# EAGLE design joytester (EAGLE 9.0.1)
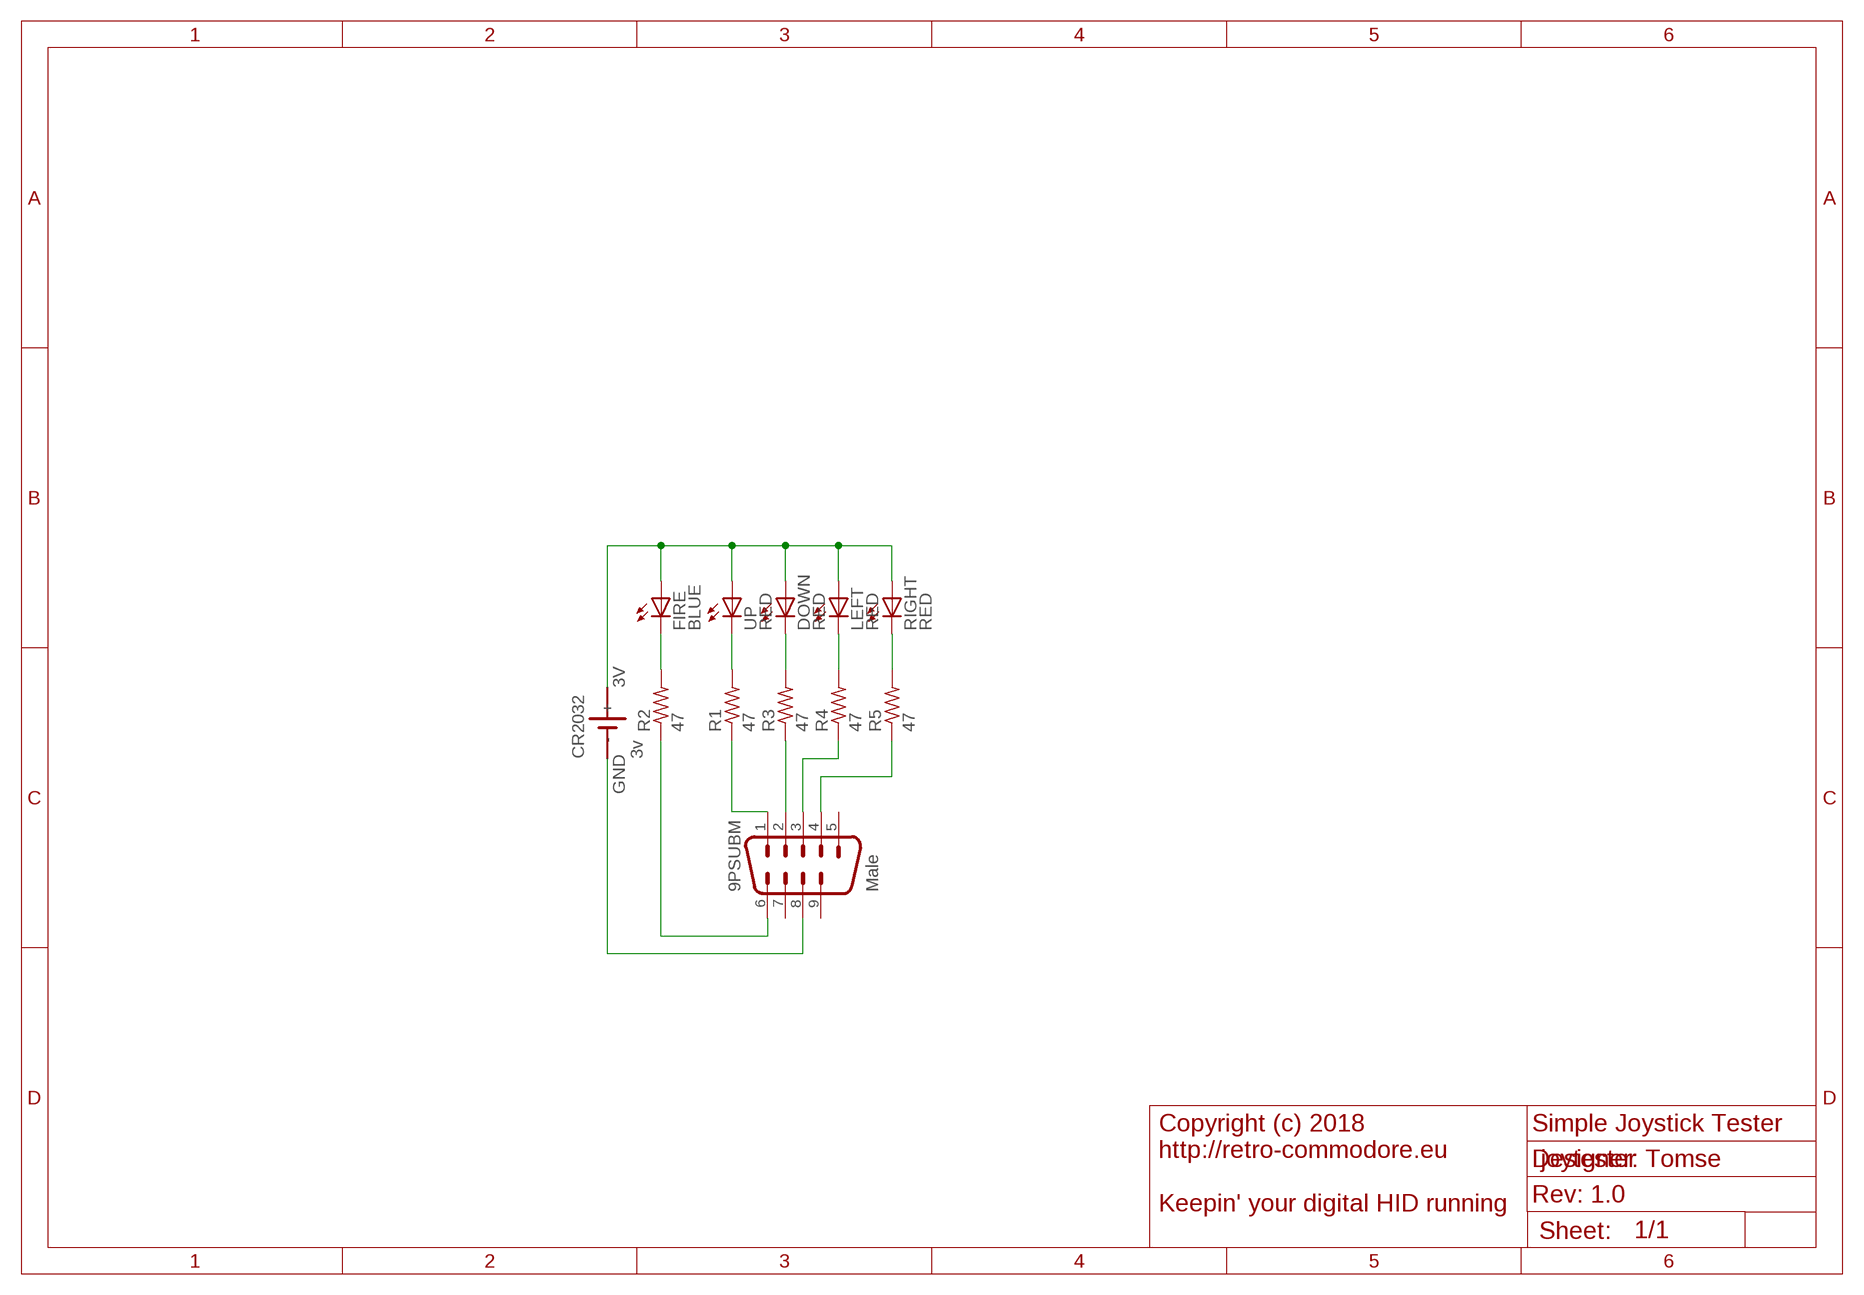
[diagram p0: schematic, sheet 1]

## Parts
9PSUBM  Male  M09D  [M09D]
CR2032  3v  SN2032  [SN2032]
DOWN  RED  LED5MM  [LED5MM]
FIRE  BLUE  LED5MM  [LED5MM]
LEFT  RED  LED5MM  [LED5MM]
R1  47  R-US_0207/12  [0207/12]
R2  47  R-US_0207/12  [0207/12]
R3  47  R-US_0207/12  [0207/12]
R4  47  R-US_0207/12  [0207/12]
R5  47  R-US_0207/12  [0207/12]
RIGHT  RED  LED5MM  [LED5MM]
UP  RED  LED5MM  [LED5MM]

## Nets
3V: CR2032.+ DOWN.A FIRE.A LEFT.A RIGHT.A UP.A
DOWN: 9PSUBM.2 R3.1
GND: 9PSUBM.8 CR2032.-
N$1: FIRE.K(C) R2.2
N$2: LEFT.K(C) R4.2
N$3: R5.2 RIGHT.K(C)
N$4: R1.2 UP.K(C)
N$5: DOWN.K(C) R3.2
N$6: 9PSUBM.6 R2.1
N$7: 9PSUBM.3 R4.1
N$8: 9PSUBM.4 R5.1
UP: 9PSUBM.1 R1.1
Unconnected: 9PSUBM.5 9PSUBM.7 9PSUBM.9

## Notes on the sheet
- Simple Joystick Tester
- Designer: Tomse
- Rev: 1.0
- Copyright (c) 2018
  http://retro-commodore.eu
  
  Keepin' your digital HID running

## Library data of the parts
9PSUBM = con-subd:M09: SUB-D; OC_FARNELL: unknown; OC_NEWARK: unknown
CR2032 = sn2032:SN2032: LI BATTERY
DOWN FIRE LEFT RIGHT UP = adafruit:LED: LED OSRAM: - CHIPLED LG R971, LG N971, LY N971, LG Q971, LY Q971, LO R971, LY R971 LH N974, LH R974 LS Q976, LO Q976, LY Q976 LO Q996 - Hyper CHIPLED LW Q18S LB Q993, LB Q99A, LB R99A - SideLED LS A670, LO A670, LY A670, LG A670, LP A670 LB A673, LV A673, LT A673, LW A673 LH A674 LY A675 LS A676, LA A676, LO A676, LY A676, LW A676 LS A679, LY A679, LG A679 - Hyper Micro SIDELED® LS Y876, LA Y876, LO Y876, LY Y876 LT Y87S - SmartLED LW L88C, LW L88S LB L89C, LB L89S, LG L890 LS L89K, LO L89K, LY L89K LS L896, LA L896, LO L896, LY L896 - TOPLED LS T670, LO T670, LY T670, LG T670, LP T670 LSG T670, LSP T670, LSY T670, LOP T670, LYG T670 LG T671, LOG T671, LSG T671 LB T673, LV T673, LT T673, LW T673 LH T674 LS T676, LA T676, LO T676, LY T676, LB T676, LH T676, LSB T676, LW T676 LB T67C, LV T67C, LT T67C, LS T67K, LO T67K, LY T67K, LW E67C LS E67B, LA E67B, LO E67B, LY E67B, LB E67C, LV E67C, LT E67C LW T67C LS T679, LY T679, LG T679 LS T770, LO T770, LY T770, LG T770, LP T770 LB T773, LV T773, LT T773, LW T773 LH T774 LS E675, LA E675, LY E675, LS T675 LS T776, LA T776, LO T776, LY T776, LB T776 LHGB T686 LT T68C, LB T68C - Hyper Mini TOPLED® LB M676 - Mini TOPLED Santana® LG M470 LS M47K, LO M47K, LY M47K Source: http://www.osram.convergy.de/
R1-R5 = adafruit:R-US_: RESISTOR, American symbol

## Board
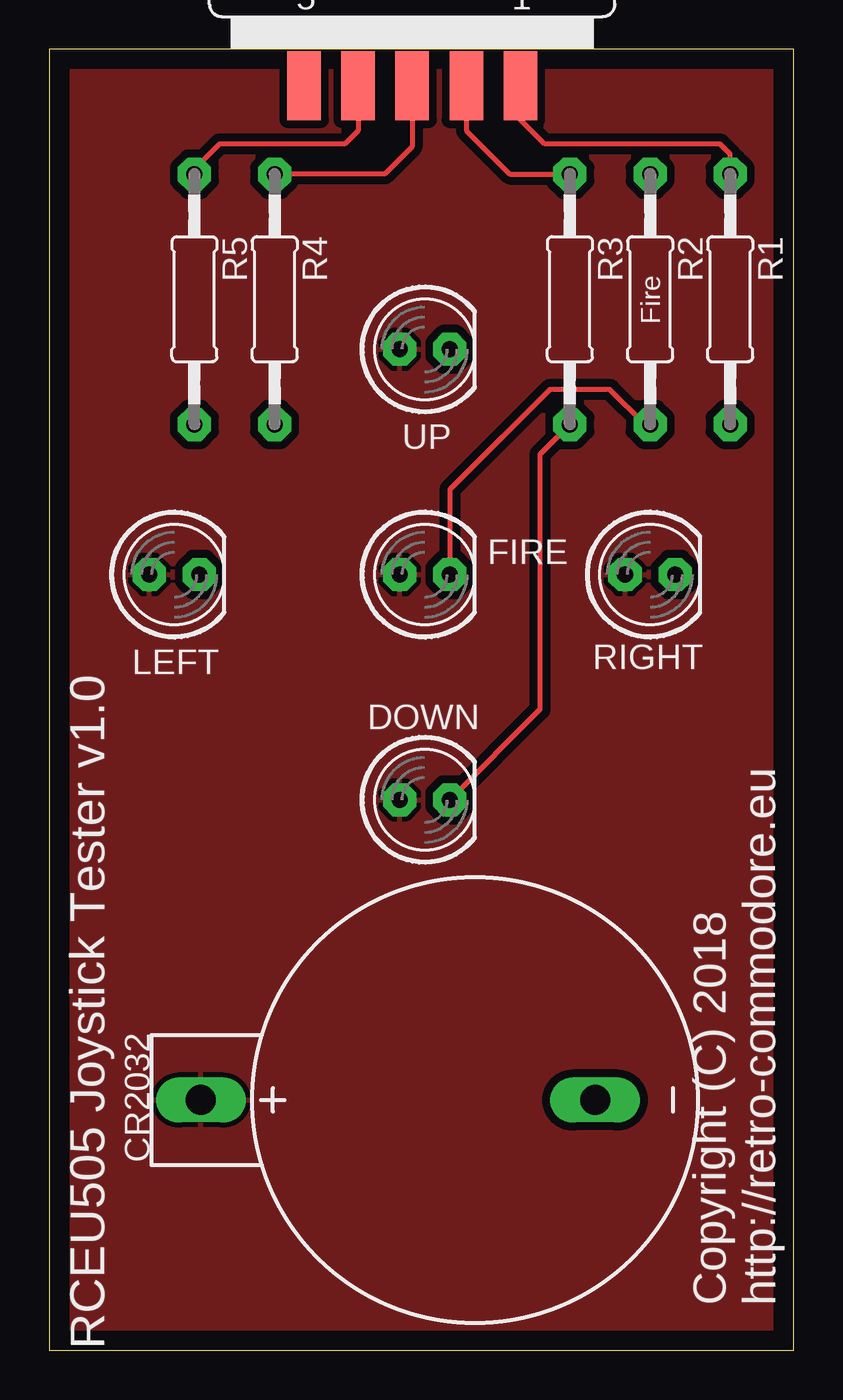
[diagram p1: board, top side]
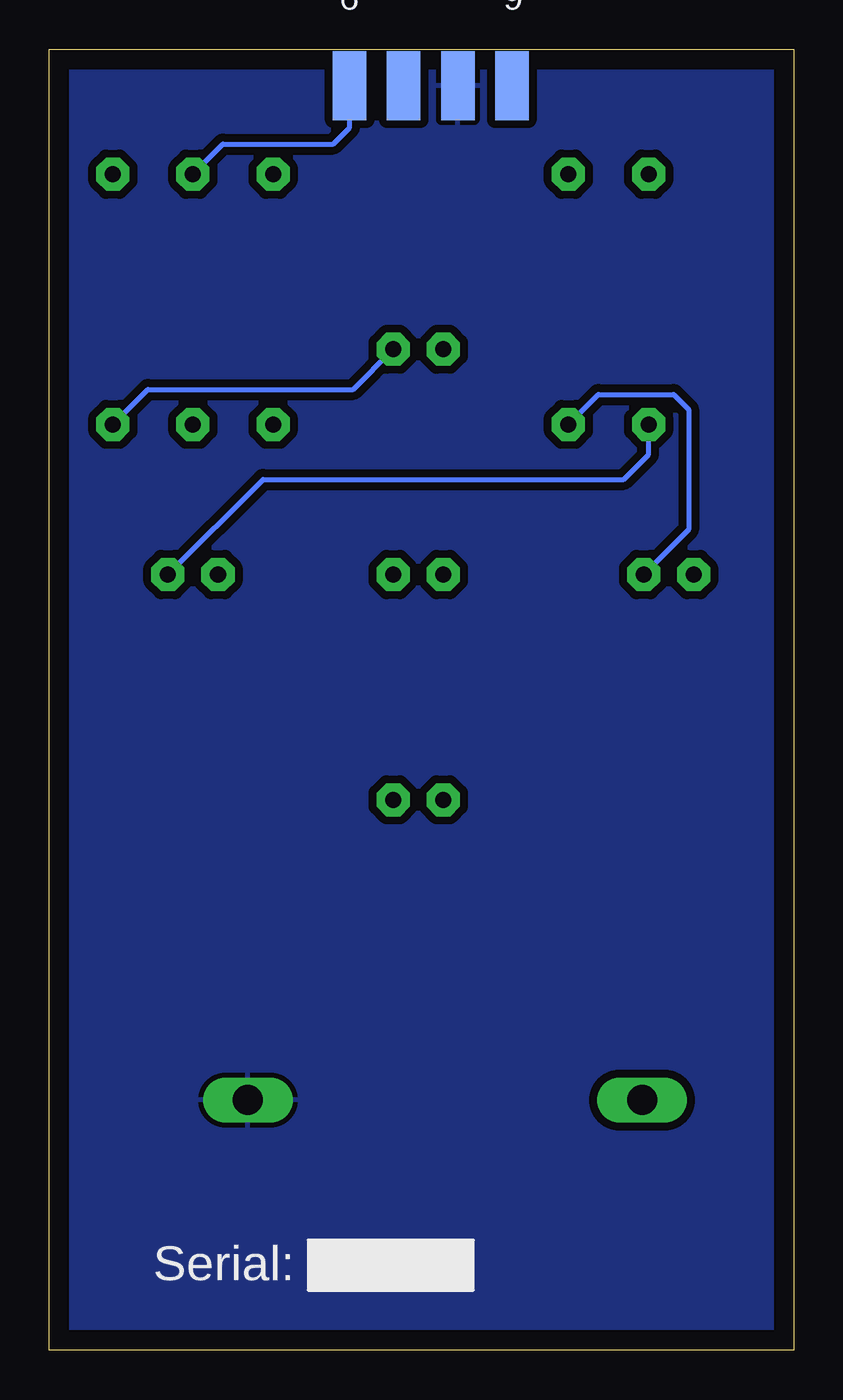
[diagram p2: board, bottom side, seen from below]

Size 37.77 x 66.03 mm. Coordinates in mm from the lower left corner, seen from the top.
Outline: 0,0 37.77,0 37.77,66.03 0,66.03 0,0
Copper layers (1*16): Top 0.035mm / dielectric 1.5mm / Bottom 0.035mm
Design rules "default": minimum track width 6mil, minimum drill 0.35mm, track to track 6mil, track to pad 6mil, pad to pad 6mil, via to via 6mil, smd to smd 6mil, copper to edge 40mil, drill to drill 6mil, minimum pad ring 10mil, minimum via ring 8mil, stop-mask expansion 4mil, vias tented up to drill 0mil, thermal gap 10mil

### Footprints (pad centres in the part's own frame; a part is rotated, then mirrored left to right if it is on the bottom)
M09D = smd 1.7 x 3.5: 1 5.486,-6.045; 2 2.743,-6.045; 3 0,-6.045; 4 -2.743,-6.045; 5 -5.486,-6.045 | smd 1.7 x 3.5 bottom: 6 4.115,-6.045; 7 1.372,-6.045; 8 -1.372,-6.045; 9 -4.115,-6.045
SN2032 = drill 1.524 long: + 0,13.9; - 0,-6.1
LED5MM = drill 0.813 pad 1.676 octagon: A -1.27,0; K 1.27,0
0207/12 = drill 0.813 pad 1.676 octagon: 1 -6.35,0; 2 6.35,0

### Placement (x,y rotation side)
9PSUBM  18.41,70.23 0 top
CR2032  21.59,12.7 90 top
DOWN  19.05,27.94 0 top
FIRE  19.05,39.37 0 top
LEFT  6.35,39.37 0 top
R1  34.54,53.34 270 top
R2  30.48,53.34 270 top
R3  26.42,53.34 270 top
R4  11.43,53.34 270 top
R5  7.37,53.34 270 top
RIGHT  30.48,39.37 0 top
UP  19.05,50.8 0 top

### Tracks (layer width: path | path; a pad name or v marks a point on that pad's centre or on a via)
3V
  pour Top (isolate 0.406): -3.05,68.83 -3.05,-1.27 -2.79,-1.52 -2.03,-2.29 39.88,-2.29 39.88,68.83
DOWN
  Top 0.254: 9PSUBM.2 21.16,61.9 23.37,59.69 R3.1
GND
  pour Bottom (isolate 0.406): -4.32,68.58 -4.32,-1.78 -3.3,-2.79 39.88,-2.79 39.88,69.09 -3.81,69.09
N$1
  Top 0.254: R2.2 30.23,46.99 28.45,48.77 25.4,48.77 20.32,43.69 FIRE.K
N$2
  Bottom 0.254: R4.2 9.91,48.51 6.1,48.51 5.33,47.75 5.33,41.66 LEFT.K
N$3
  Bottom 0.254: R5.2 7.37,45.47 8.64,44.2 26.92,44.2 RIGHT.K
N$4
  Bottom 0.254: R1.2 32.77,48.77 22.35,48.77 UP.K
N$5
  Top 0.254: R3.2 24.89,45.47 24.89,32.51 DOWN.K
N$6
  Bottom 0.254: R2.1 28.96,61.21 23.37,61.21 22.53,62.05 9PSUBM.6
N$7
  Top 0.254: 9PSUBM.3 18.41,61.09 17.02,59.69 R4.1
N$8
  Top 0.254: 9PSUBM.4 15.67,61.9 14.99,61.21 8.64,61.21 7.37,59.94 R5.1
UP
  Top 0.254: R1.1 34.54,60.71 34.04,61.21 25.15,61.21 23.9,62.46 9PSUBM.1

### Text on the board
tPlace: Fire | RCEU505 Joystick Tester v1.0 | Copyright (C) 2018 / http://retro-commodore.eu
bPlace: Serial: